# EAGLE design ConverterBoard (EAGLE 8.3.2)
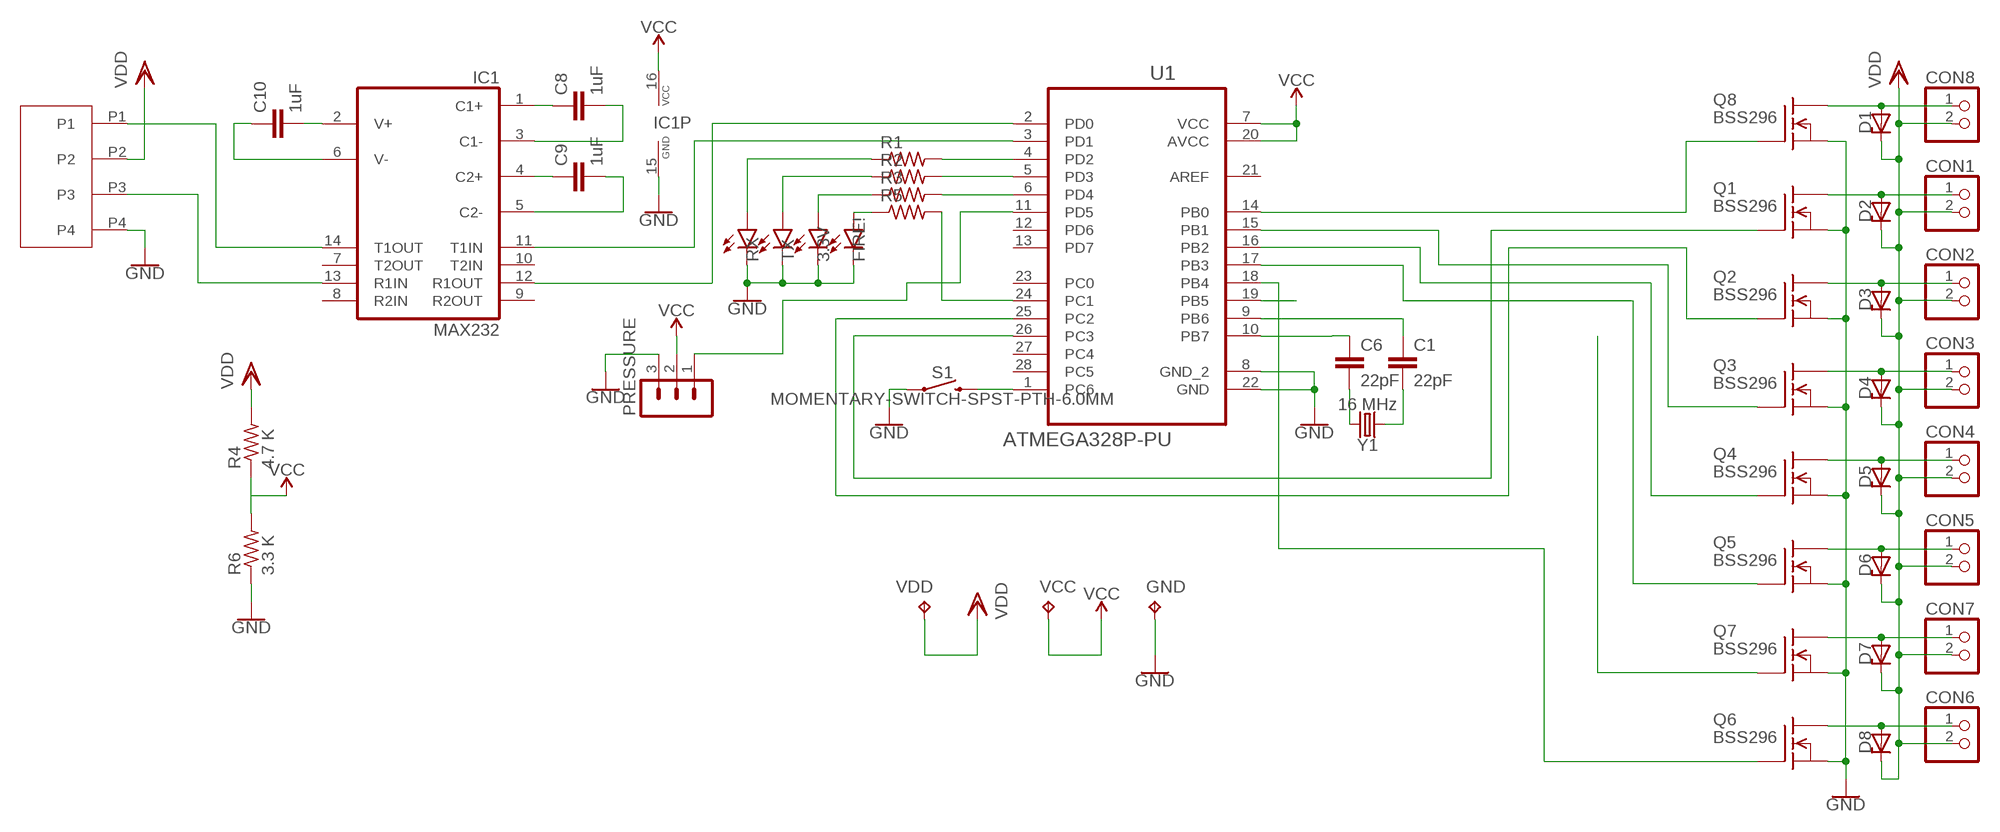
[diagram p0: schematic, sheet 1]

## Parts
3.3V  BLUE  LED-BLUE0603  [LED-0603]
C1  22pF  470PF-0603-50V-5%  [0603]
C6  22pF  470PF-0603-50V-5%  [0603]
C8  1uF  470PF-0603-50V-5%  [0603]
C9  1uF  470PF-0603-50V-5%  [0603]
C10  1uF  470PF-0603-50V-5%  [0603]
CON1  PINHD-1X2  [1X02]
CON2  PINHD-1X2  [1X02]
CON3  PINHD-1X2  [1X02]
CON4  PINHD-1X2  [1X02]
CON5  PINHD-1X2  [1X02]
CON6  PINHD-1X2  [1X02]
CON7  PINHD-1X2  [1X02]
CON8  PINHD-1X2  [1X02]
D1  BZX90  [DO34Z7]
D2  BZX90  [DO34Z7]
D3  BZX90  [DO34Z7]
D4  BZX90  [DO34Z7]
D5  BZX90  [DO34Z7]
D6  BZX90  [DO34Z7]
D7  BZX90  [DO34Z7]
D8  BZX90  [DO34Z7]
FIRE!  BLUE  LED-BLUE0603  [LED-0603]
GND  TPTP11R  [TP11R]
IC1  MAX232  [DIL16]
PRESSURE  MA03-1  [MA03-1]
Q1  BSS296  [TO92]
Q2  BSS296  [TO92]
Q3  BSS296  [TO92]
Q4  BSS296  [TO92]
Q5  BSS296  [TO92]
Q6  BSS296  [TO92]
Q7  BSS296  [TO92]
Q8  BSS296  [TO92]
R1  R-US_0204/2V  [0204V]
R2  R-US_0204/2V  [0204V]
R3  R-US_0204/2V  [0204V]
R4  4.7 K  R-US_0204/2V  [0204V]
R5  R-US_0204/2V  [0204V]
R6  3.3 K  R-US_0204/2V  [0204V]
RX  BLUE  LED-BLUE0603  [LED-0603]
S1  MOMENTARY-SWITCH-SPST-PTH-6.0MM  [TACTILE_SWITCH_PTH_6.0MM]
TX  BLUE  LED-BLUE0603  [LED-0603]
U1  ATMEGA328P-PU  [DIP254P762X457-28]
U$2  MINI_FIT_JR_4PIN_VERT  [MINI_FIT_JR_4PIN_VERT]
VCC  TPTP11R  [TP11R]
VDD  TPTP11R  [TP11R]
Y1  16 MHz  CRYSTALPTH-HC49UV  [HC49U]

## Nets
CON1_GND: CON1.1 D2.A Q1.2(D)
CON2_GND: CON2.1 D3.A Q2.2(D)
CON3_GND: CON3.1 D4.A Q3.2(D)
CON4_GND: CON4.1 D5.A Q4.2(D)
CON5_GND: CON5.1 D6.A Q5.2(D)
CON6_GND: CON6.1 D8.A Q6.2(D)
CON7_GND: CON7.1 D7.A Q7.2(D)
CON8_GND: CON8.1 D1.A Q8.2(D)
GND: 3.3V.C FIRE!.C GND.TP IC1.15(GND) PRESSURE.3 Q1.3(S) Q2.3(S) Q3.3(S) Q4.3(S) Q5.3(S) Q6.3(S) Q7.3(S) Q8.3(S) R6.1 RX.C S1.1 TX.C U1.8(GND_2) U1.22(GND) U$2.P4
N$1: R3.2 U1.6(PD4)
N$2: FIRE!.A R5.1
N$3: R4.1 R6.2
N$4: R5.2 U1.24(PC1)
N$5: C6.2 Y1.2
N$6: PRESSURE.1 U1.11(PD5)
N$7: R1.2 U1.4(PD2)
N$8: R2.2 U1.5(PD3)
N$9: C8.1 IC1.1(C1+)
N$10: C9.1 IC1.4(C2+)
N$11: C8.2 IC1.3(C1-)
N$12: C9.2 IC1.5(C2-)
N$13: C10.2 IC1.2(V+)
N$14: C10.1 IC1.6(V-)
N$15: C1.2 Y1.1
POWER: 3.3V.A R3.1
Q1: Q1.1(G) U1.26(PC3)
Q2: Q2.1(G) U1.25(PC2)
Q3: Q3.1(G) U1.15(PB1)
Q4: Q4.1(G) U1.16(PB2)
Q5: Q5.1(G) U1.17(PB3)
Q6: Q6.1(G) U1.18(PB4)
Q7: Q7.1(G) U1.19(PB5)
Q8: Q8.1(G) U1.14(PB0)
RESET: S1.3 U1.1(PC6)
RS232_RX-ATMEGA_TX: IC1.12(R1OUT) U1.2(PD0)
RS232_TX-ATMEGA_RX: IC1.11(T1IN) U1.3(PD1)
RX: IC1.13(R1IN) U$2.P3
RX_ON: R1.1 RX.A
TX: IC1.14(T1OUT) U$2.P1
TX_ON: R2.1 TX.A
VCC: IC1.16(VCC) PRESSURE.2 U1.7(VCC) U1.20(AVCC) VCC.TP
VDD: CON1.2 CON2.2 CON3.2 CON4.2 CON5.2 CON6.2 CON7.2 CON8.2 D1.C D2.C D3.C D4.C D5.C D6.C D7.C D8.C R4.2 U$2.P2 VDD.TP
XTAL1: C1.1 U1.9(PB6)
XTAL2: C6.1 U1.10(PB7)
Unconnected: IC1.7(T2OUT) IC1.8(R2IN) IC1.9(R2OUT) IC1.10(T2IN) U1.12(PD6) U1.13(PD7) U1.21(AREF) U1.23(PC0) U1.27(PC4) U1.28(PC5)

## Library data of the parts
3.3V FIRE! RX TX = SparkFun-LED:LED-BLUE: Blue SMD LED Used in manufacturing of various products at SparkFun Packages: 0603 - SMD 0603 package [Product Link] <http://www.digikey.com/product-detail/en/SMLE12BC7TT86/511-1589-2-ND/1641808> 1206 - SMD1206 package [Product Link] <http://www.digikey.com/product-detail/en/lite-on-inc/LTST-C150TBKT/160-1643-1-ND/573584> SparkFun Products: ESP8266 Thing-Dev Board <https://www.sparkfun.com/products/13711> RedBoard <https://www.sparkfun.com/products/12757>; PROD_ID: DIO-08575
C1 C6 C8-C10 = SparkFun-Capacitors:470PF: 470pF ceramic capacitors A capacitor is a passive two-terminal electrical component used to store electrical energy temporarily in an electric field.; PROD_ID: CAP-07884; VALUE: 470pF
CON1-CON8 = pinhead:PINHD-1X2: PIN HEADER
D1-D8 = diode:BZX90: Z DIODE
GND VCC VDD = testpad:TP: Test pad
IC1 = maxim:MAX232: RS232 TRANSCEIVER; MF: MAXIM; MPN: MAX232ACPE+; OC_FARNELL: 9723773; OC_NEWARK: 68K4544
PRESSURE = con-lstb:MA03-1: PIN HEADER; OC_FARNELL: unknown; OC_NEWARK: unknown
Q1-Q8 = transistor-fet:BSS296: N-Channel Enhancement MOSFET not checked
R1-R6 = resistor:R-US_: RESISTOR, American symbol
S1 = SparkFun-Switches:MOMENTARY-SWITCH-SPST: Momentary Switch (Pushbutton) - SPST Normally-open (NO) SPST momentary switches (buttons, pushbuttons). Variants PTH-12MM - 12mm square, through-hole Momentary Pushbutton Switch - 12mm Square <https://www.sparkfun.com/products/9190> (COM-09190) PTH-6.0MM, PTH-6.0MM-KIT - 6.0mm square, through-hole Mini Pushbutton Switch <https://www.sparkfun.com/products/97> (COM-00097) KIT package intended for soldering kit's - only one side of pads' copper is exposed. PTH-RIGHT-ANGLE-KIT - Right-angle, through-hole Right Angle Tactile Button <https://www.sparkfun.com/products/10791> - Used on SparkFun BigTime Watch Kit <https://www.sparkfun.com/products/11734> SMD-12MM - 12mm square, surface-mount Tactile Button - SMD (12mm) <https://www.sparkfun.com/products/12993> (COM-12993) Used on SparkFun PicoBoard <https://www.sparkfun.com/products/11888> SMD-4.5MM - 4.5mm Square Trackball Switch Used on SparkFun Blackberry Trackballer Breakout <https://www.sparkfun.com/products/13169> SMD-4.6MMX2.8MM - 4.60mm x 2.80mm, surface mount Used on SparkFun SAMD21 Mini Breakout <https://www.sparkfun.com/products/13664> SMD-5.2MM, SMD-5.2-REDUNDANT - 5.2mm square, surface-mount Mini Pushbutton Switch - SMD <https://www.sparkfun.com/products/8720> (COM-08720) Used on Arduino Pro Mini <https://www.sparkfun.com/products/11114> REDUNDANT package connects both switch circuits together SMD-6.0X3.5MM - 6.0 x 3.5mm, surface mount Momentary Reset Switch SMD <https://www.sparkfun.com/products/8229> (COM-08229) SMD-6.2MM-TALL - 6.2mm square, surface mount Tactile Button - SMD (6mm) <https://www.sparkfun.com/products/12992> Used on SparkFun Digital Sandbox <https://www.sparkfun.com/products/12651> SMD-RIGHT-ANGLE - Right-angle, surface mount Used on SparkFun Block for Intel® Edison - Arduino <https://www.sparkfun.com/products/13036>; PROD_ID: SWCH-08441; SF_SKU: COM-00097
U1 = Atmel_By_element14_Batch_1-00:ATMEGA328P-PU: 8-bit Microcontroller with In-System Programmable Flash; MPN: ATMEGA328P-PU; OC_FARNELL: 1715487; OC_NEWARK: 15R0268; PACKAGE: PDIP-28; SUPPLIER: Atmel
U$2 = 15-24-6041:MINI_FIT_JR_4PIN_VERT
Y1 = SparkFun-Clocks:CRYSTAL: Crystals (Generic) These are passive quartz crystals, which can be used as a clock source for a microcontroller. Crystal's are two-terminal devices. They require external "load" capacitors to generate an oscillating signal.

## Board
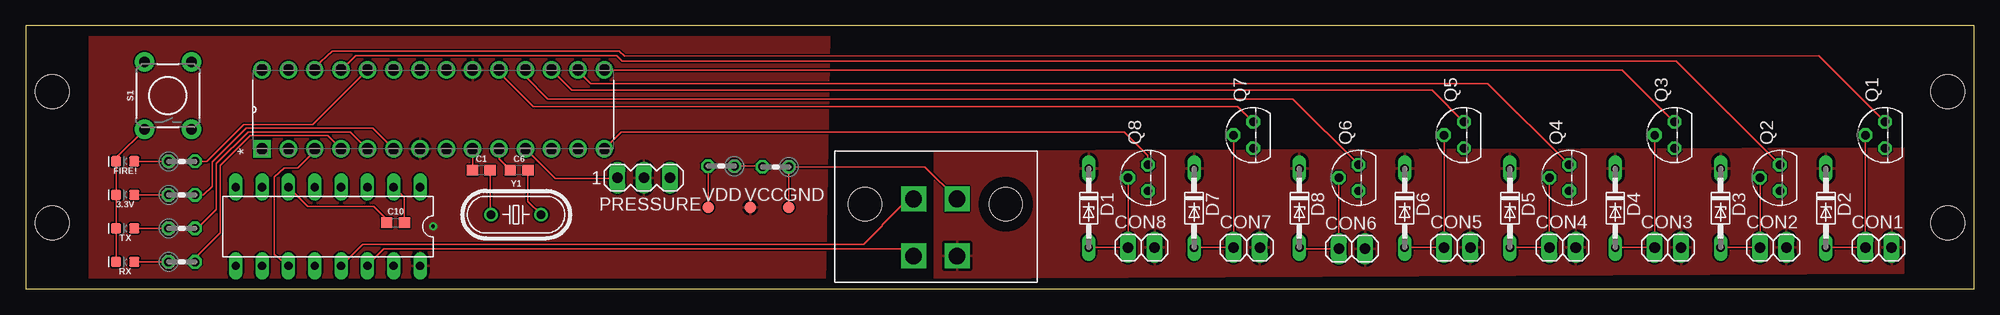
[diagram p1: board, top side]
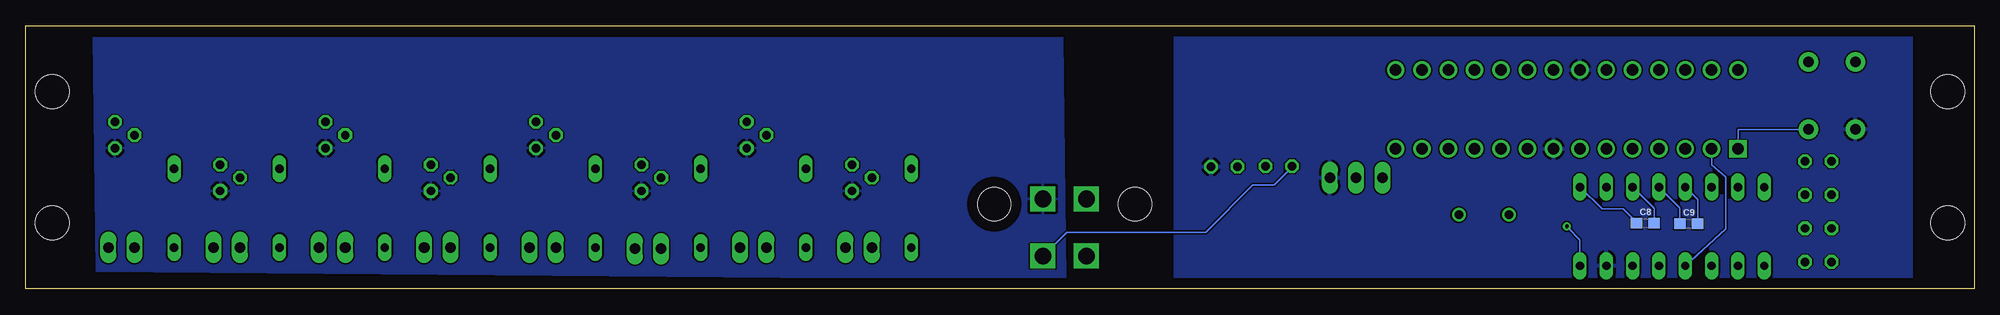
[diagram p2: board, bottom side, seen from below]

Size 187.96 x 25.4 mm. Coordinates in mm from the lower left corner, seen from the top.
Outline: 0,0 187.96,0 187.96,25.4 0,25.4 0,0
Copper layers (1*16): Top 0.035mm / dielectric 1.5mm / Bottom 0.035mm
Design rules "default": minimum track width 6mil, minimum drill 0.35mm, track to track 6mil, track to pad 6mil, pad to pad 6mil, via to via 6mil, smd to smd 6mil, copper to edge 40mil, drill to drill 6mil, minimum pad ring 10mil, minimum via ring 8mil, stop-mask expansion 4mil, vias tented up to drill 0mil, thermal gap 10mil
Holes 3.26 mm at 2.54,6.35 2.54,19.05 185.42,19.05 185.42,6.35

### Footprints (pad centres in the part's own frame; a part is rotated, then mirrored left to right if it is on the bottom)
LED-0603 = smd 1 x 1: A -0.877,0; C 0.877,0
0603 = smd 1.1 x 1: 1 -0.85,0; 2 0.85,0
1X02 = drill 1.016 long: 1 -1.27,0; 2 1.27,0
DO34Z7 = drill 0.813 long: A 3.81,0; C -3.81,0
TP11R = smd 1.1 x 1.1: TP 0,0
DIL16 = drill 0.813 long: 1 -8.89,-3.81; 2 -6.35,-3.81; 3 -3.81,-3.81; 4 -1.27,-3.81; 5 1.27,-3.81; 6 3.81,-3.81; 7 6.35,-3.81; 8 8.89,-3.81; 9 8.89,3.81; 10 6.35,3.81; 11 3.81,3.81; 12 1.27,3.81; 13 -1.27,3.81; 14 -3.81,3.81; 15 -6.35,3.81; 16 -8.89,3.81
MA03-1 = drill 1.016 long: 1 -2.54,0; 2 0,0; 3 2.54,0
TO92 = drill 0.813 octagon: 1 1.27,0; 2 0,1.905; 3 -1.27,0
0204V = drill 0.813 octagon: 1 -1.27,0; 2 1.27,0
TACTILE_SWITCH_PTH_6.0MM = drill 1.016 pad 1.88: 1 -3.251,2.261; 2 3.251,2.261; 3 -3.251,-2.261; 4 3.251,-2.261
DIP254P762X457-28 = drill 1.118 square: 1 -7.62,33.02 | drill 1.118: 2 -7.62,30.48; 3 -7.62,27.94; 4 -7.62,25.4; 5 -7.62,22.86; 6 -7.62,20.32; 7 -7.62,17.78; 8 -7.62,15.24; 9 -7.62,12.7; 10 -7.62,10.16; 11 -7.62,7.62; 12 -7.62,5.08; 13 -7.62,2.54; 14 -7.62,0; 15 0,0; 16 0,2.54; 17 0,5.08; 18 0,7.62; 19 0,10.16; 20 0,12.7; 21 0,15.24; 22 0,17.78; 23 0,20.32; 24 0,22.86; 25 0,25.4; 26 0,27.94; 27 0,30.48; 28 0,33.02
MINI_FIT_JR_4PIN_VERT = drill 1.6 square: P1 0,0; P2 4.191,0; P3 0,5.512; P4 4.191,5.512 | hole 3.2: -4.699,5.004; 8.89,5.004
HC49U = drill 0.813: 1 -2.413,0; 2 2.413,0

### Placement (x,y rotation side)
3.3V  9.58,9.07 180 top
C1  43.94,11.46 0 top
C6  47.57,11.46 0 top
C8  31.72,6.32 0 bottom
C9  27.53,6.27 0 bottom
C10  35.66,6.38 0 top
CON1  178.74,3.99 0 top
CON2  168.58,3.99 0 top
CON3  158.42,3.99 0 top
CON4  148.26,3.99 0 top
CON5  138.1,3.99 0 top
CON6  127.94,3.86 0 top
CON7  117.78,3.99 0 top
CON8  107.62,3.99 0 top
D1  102.54,7.8 270 top
D2  173.66,7.8 270 top
D3  163.5,7.8 270 top
D4  153.34,7.8 270 top
D5  143.18,7.8 270 top
D6  133.02,7.8 270 top
D7  112.7,7.8 270 top
D8  122.86,7.8 270 top
FIRE!  9.58,12.31 180 top
GND  73.61,7.86 0 top
IC1  29.13,6.02 180 top
PRESSURE  59.61,10.72 0 top
Q1  179.37,14.85 90 top
Q2  169.21,10.72 90 top
Q3  159.05,14.85 90 top
Q4  148.89,10.72 90 top
Q5  138.73,14.85 90 top
Q6  128.57,10.72 90 top
Q7  118.41,14.85 90 top
Q8  108.25,10.72 90 top
R1  15.04,2.59 0 top
R2  15.04,5.83 0 top
R3  15.04,9.07 0 top
R4  67.08,11.84 180 top
R5  15.04,12.31 0 top
R6  72.34,11.79 180 top
RX  9.58,2.59 180 top
S1  13.7,18.66 90 top
TX  9.58,5.83 180 top
U1  55.8,21.13 90 top
U$2  85.65,3.16 0 top
VCC  69.86,7.86 0 top
VDD  65.81,7.86 0 top
Y1  47.29,7.16 0 top

### Tracks (layer width: path | path; a pad name or v marks a point on that pad's centre or on a via)
CON1_GND
  Top 0.152: Q1.2 CON1.1 D2.A
CON2_GND
  Top 0.152: Q2.2 CON2.1 D3.A
CON3_GND
  Top 0.152: Q3.2 CON3.1 D4.A
CON4_GND
  Top 0.152: Q4.2 CON4.1 D5.A
CON5_GND
  Top 0.152: Q5.2 CON5.1 D6.A
CON6_GND
  Top 0.152: Q6.2 CON6.1 122.99,3.86 D8.A
CON7_GND
  Top 0.152: D7.A CON7.1 Q7.2
CON8_GND
  Top 0.152: Q8.2 CON8.1 D1.A
GND
  Top 0.152: RX.C TX.C 3.3V.C FIRE!.C 8.7,12.66 S1.1 | U$2.P4 86.73,11.79 R6.1 GND.TP
  pour Bottom: 87.95,24.3 87.62,0.88 181.15,1.7 181.48,24.49
  pour Bottom: 6.05,25.02 77.06,25.02 77.06,0.36 6.05,0.36
N$1
  Top 0.152: R3.2 17.12,9.07 17.96,9.91 17.96,12.24 21.23,15.52 33.48,15.52 U1.6
N$2
  Top 0.152: FIRE!.A R5.1
N$3
  Top 0.152: R4.1 71.02,11.84 R6.2
N$4
  Top 0.152: R5.2 17.44,12.31 21.01,15.88 27.69,15.88 U1.24
N$5
  Top 0.152: C6.2 48.42,8.45 Y1.2
N$6
  Top 0.152: U1.11 48.21,13.51 51.05,10.67 57.02,10.67 PRESSURE.1
N$7
  Top 0.152: R1.2 16.31,2.92 18.77,5.38 18.77,11.91 21.67,14.81 29.11,14.81 U1.4
N$8
  Top 0.152: R2.2 16.55,5.83 18.36,7.64 18.36,12.09 21.44,15.16 31.29,15.16 U1.5
N$9
  Bottom 0.152: C8.1 32.58,6.44 33.83,7.7 35.89,7.7 IC1.1
N$10
  Bottom 0.152: C9.1 28.38,7.81 IC1.4
N$11
  Bottom 0.152: C8.2 30.88,7.76 IC1.3
N$12
  Bottom 0.152: C9.2 26.68,8.65 IC1.5
N$13
  Top 0.152: C10.2 36.51,8.8 IC1.2
N$14
  Top 0.152: C10.1 34.81,6.72 33.58,7.95 27.2,7.95 IC1.6
N$15
  Top 0.152: C1.2 44.79,7.25 Y1.1
POWER
  Top 0.152: 3.3V.A R3.1
Q1
  Top 0.152: U1.26 27.86,21.41 29.57,22.94 57.23,22.94 57.76,22.48 172.99,22.5 Q1.1
Q2
  Top 0.152: U1.25 30.43,21.13 31.83,22.53 57,22.53 57.53,22 159.21,22 Q2.1
Q3
  Top 0.152: U1.15 154.04,21.13 Q3.1
Q4
  Top 0.152: U1.16 53.26,21.08 54.51,19.84 141.05,19.84 Q4.1
Q5
  Top 0.152: U1.17 52.68,19.18 135.67,19.18 Q5.1
Q6
  Top 0.152: U1.18 48.18,20.52 50.37,18.34 122.22,18.34 Q6.1
Q7
  Top 0.152: U1.19 45.64,20.9 48.95,17.6 116.93,17.6 Q7.1
Q8
  Top 0.152: Q8.1 108.25,12.85 105.97,15.14 57.43,15.14 U1.14
RESET
  Bottom 0.152: S1.3 22.77,15.4 U1.1
RS232_RX-ATMEGA_TX
  Bottom 0.152: U1.2 25.32,11.96 23.95,10.82 23.95,5.77 IC1.12
RS232_TX-ATMEGA_RX
  Top 0.152: U1.3 27.86,13.31 26.21,11.66 24.94,11.66 23.95,10.79 23.95,3.3 IC1.11
RX
  Top 0.152: U$2.P3 85.13,8.67 82.6,6.15 82.6,6.08 80.82,4.3 32.5,4.3 IC1.13
RX_ON
  Top 0.152: RX.A R1.1
TX
  Top 0.152: IC1.14 32.94,2.27 34.53,3.86 84.95,3.86 U$2.P1
TX_ON
  Top 0.152: TX.A R2.1
VCC  (via drill 0.35)  (1 unrouted)
  Bottom 0.152: IC1.16 38.02,4.72 39.17,5.87 | 39.17,5.89 v39.29,6.02
  pour Top: 6.15,25.02 77.52,24.56 77.09,0.43 6.15,0.38
VDD
  Top 0.152: 65.84,11.86 R4.2 VDD.TP
  Bottom 0.152: 65.81,11.58 R4.2 65.81,11.71 67.51,10.01 69.57,10.01 74.12,5.46 87.54,5.46 U$2.P2
  pour Top: 87.64,13.3 181.18,13.6 181.15,1.5 87.62,1
XTAL1
  Top 0.152: U1.9 43.1,11.47 C1.1
XTAL2
  Top 0.152: U1.10 45.64,12.54 C6.1

### Text on the board
tValues: ATMEGA 328 PU
Measures: PEW PEW PEW | CAM SPICER | - | ERIKA KLEK | - | JACK SCHNAIBLE | - | LISA D'LIMA | CAPSTONE 2018 | WEAPONS INITIATION SYSTEM | CENTER FOR AUTOMOTIVE RESEARCH | UNDERWATER ROBOTICS